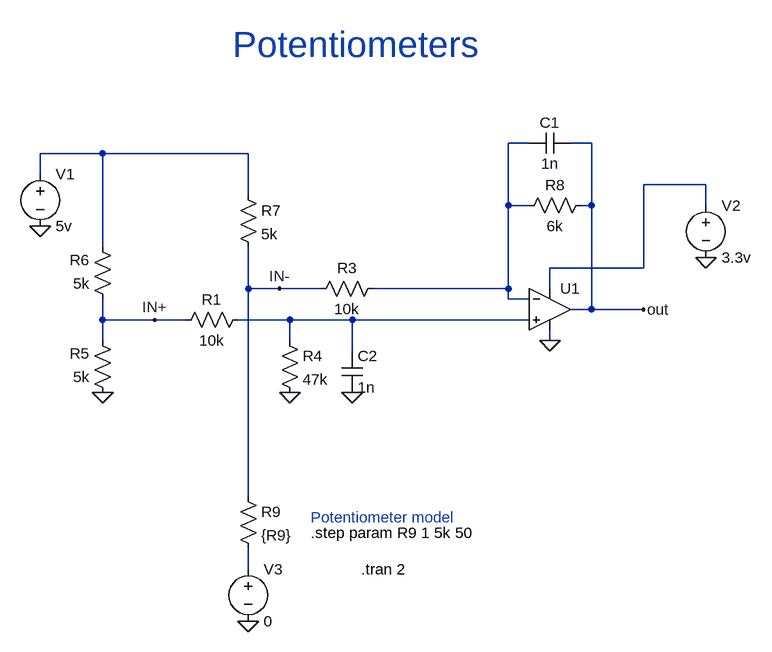
[diagram p0: schematic Suspension.asc]
Suspension.asc, the LTspice schematic file:
Version 4
SHEET 1 1068 680
WIRE 720 -144 688 -144
WIRE 816 -144 784 -144
WIRE 64 -128 -32 -128
WIRE 288 -128 64 -128
WIRE -32 -96 -32 -128
WIRE 992 -80 896 -80
WIRE 288 -64 288 -128
WIRE 688 -48 688 -144
WIRE 720 -48 688 -48
WIRE 816 -48 816 -144
WIRE 816 -48 800 -48
WIRE 992 -48 992 -80
WIRE 64 16 64 -128
WIRE 896 48 896 -80
WIRE 896 48 752 48
WIRE 288 80 288 16
WIRE 336 80 288 80
WIRE 400 80 336 80
WIRE 688 80 688 -48
WIRE 688 80 480 80
WIRE 752 80 752 48
WIRE 688 96 688 80
WIRE 720 96 688 96
WIRE 816 112 816 -48
WIRE 816 112 784 112
WIRE 896 112 816 112
WIRE 64 128 64 96
WIRE 144 128 64 128
WIRE 192 128 144 128
WIRE 352 128 272 128
WIRE 448 128 352 128
WIRE 720 128 448 128
WIRE 64 160 64 128
WIRE 352 160 352 128
WIRE 752 160 752 144
WIRE 448 176 448 128
WIRE 288 400 288 80
WIRE 288 512 288 480
FLAG 752 160 0
FLAG 992 32 0
FLAG 896 112 out
FLAG 144 128 IN+
FLAG 336 80 IN-
FLAG 352 240 0
FLAG 64 240 0
FLAG -32 -16 0
FLAG 448 240 0
FLAG 288 592 0
SYMBOL OpAmps\\UniversalOpamp 752 112 R0
SYMATTR InstName U1
SYMBOL res 816 -64 R90
WINDOW 0 0 56 VBottom 2
WINDOW 3 32 56 VTop 2
SYMATTR InstName R8
SYMATTR Value 6k
SYMBOL voltage 992 -64 R0
WINDOW 123 0 0 Left 0
WINDOW 39 0 0 Left 0
SYMATTR InstName V2
SYMATTR Value 3.3v
SYMBOL cap 784 -160 R90
WINDOW 0 0 32 VBottom 2
WINDOW 3 32 32 VTop 2
SYMATTR InstName C1
SYMATTR Value 1n
SYMBOL res 288 112 R90
WINDOW 0 0 56 VBottom 2
WINDOW 3 32 56 VTop 2
SYMATTR InstName R1
SYMATTR Value 10k
SYMBOL res 496 64 R90
WINDOW 0 0 56 VBottom 2
WINDOW 3 32 56 VTop 2
SYMATTR InstName R3
SYMATTR Value 10k
SYMBOL res 336 144 R0
SYMATTR InstName R4
SYMATTR Value 47k
SYMBOL res 80 256 R180
WINDOW 0 36 76 Left 2
WINDOW 3 36 40 Left 2
SYMATTR InstName R5
SYMATTR Value 5k
SYMBOL res 80 112 R180
WINDOW 0 36 76 Left 2
WINDOW 3 36 40 Left 2
SYMATTR InstName R6
SYMATTR Value 5k
SYMBOL voltage -32 -112 R0
WINDOW 123 0 0 Left 0
WINDOW 39 0 0 Left 0
SYMATTR InstName V1
SYMATTR Value 5v
SYMBOL cap 432 176 R0
SYMATTR InstName C2
SYMATTR Value 1n
SYMBOL res 272 -80 R0
SYMATTR InstName R7
SYMATTR Value 5k
SYMBOL res 272 384 R0
SYMATTR InstName R9
SYMATTR Value {R9}
SYMBOL voltage 288 496 R0
WINDOW 123 0 0 Left 0
WINDOW 39 0 0 Left 0
SYMATTR InstName V3
SYMATTR Value 0
TEXT 264 -296 Left 5 ;Potentiometers
TEXT 384 432 Left 2 ;Potentiometer model
TEXT 384 456 Left 2 !.step param R9 1 5k 50
TEXT 462 512 Left 2 !.tran 2

The netlist it stands for:
* Suspension.asc
XU1 N004 N001 N003 0 out level1 Avol=1Meg GBW=10Meg Vos=0 En=0 Enk=0 In=0 Ink=0 Rin=500Meg  ; pins In+ In- V+ V- OUT
R8 out N001 6k
V2 N003 0 3.3v
C1 out N001 1n
R1 N004 IN+ 10k
R3 N001 IN- 10k
R4 N004 0 47k
R5 0 IN+ 5k
R6 IN+ N002 5k
V1 N002 0 5v
C2 N004 0 1n
R7 N002 IN- 5k
R9 IN- N005 {R9}
V3 N005 0 0
* Potentiometers
* Potentiometer model
.step param R9 1 5k 50
.tran 2
.lib UniversalOpAmp1.lib
.backanno
.end